# EasyEDA schematic HF Upconverter Schematic (EasyEDA).json
TITLE: HF Upconverter; REV: 2.1.1; Date: 2018-02-09; Sheet: 1/1; Drawn By: IgrikXD
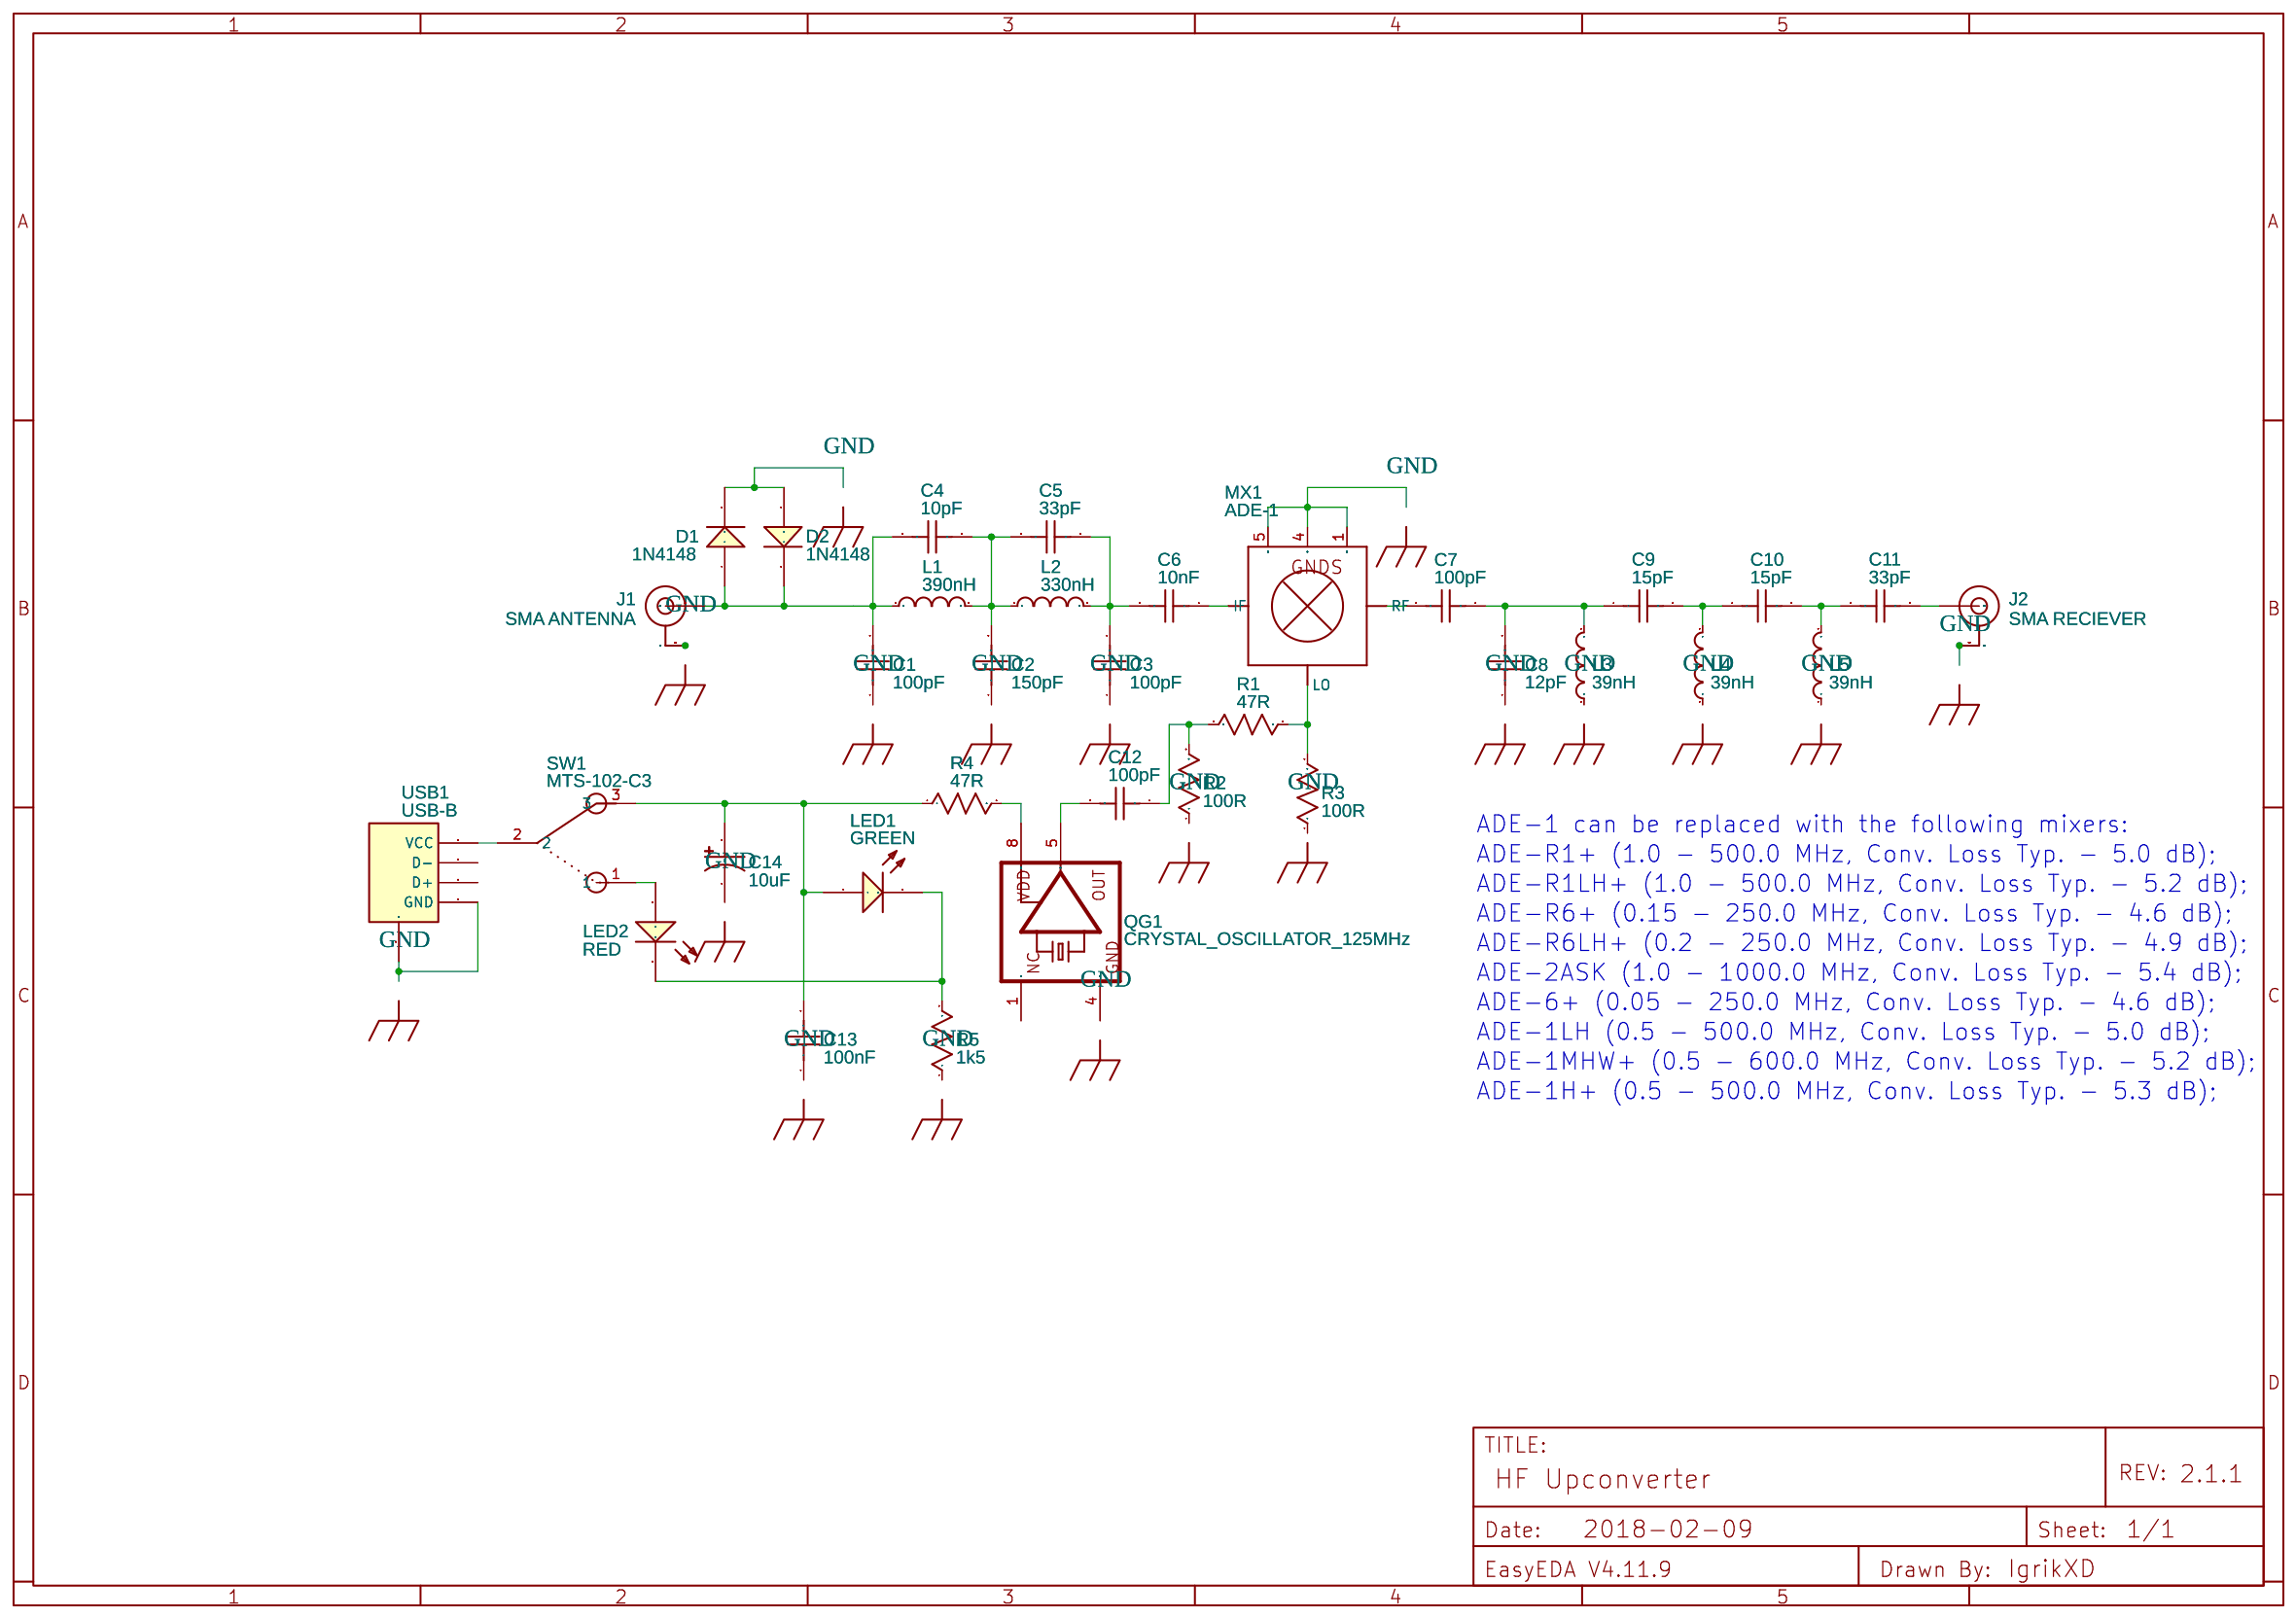
[diagram p0: schematic sheet]

## Parts
C1  100pF  [RAD-0.2]
C2  150pF  [RAD-0.2]
C3  100pF  [RAD-0.2]
C4  10pF  [RAD-0.2]
C5  33pF  [RAD-0.2]
C6  10nF  [RAD-0.2]
C7  100pF  [RAD-0.2]
C8  12pF  [RAD-0.2]
C9  15pF  [RAD-0.2]
C10  15pF  [RAD-0.2]
C11  33pF  [RAD-0.2]
C12  100pF  [RAD-0.2]
C13  100nF  [RAD-0.2]
C14  10uF  [CAP-D5.0XF2.0]
D1  1N4148  [DO-35]
D2  1N4148  [DO-35]
J1  SMA ANTENNA  [SMA-EDGE]
J2  SMA RECIEVER  [SMA-EDGE]
L1  390nH  [AXIAL-0.4]
L2  330nH  [AXIAL-0.4]
L3  39nH  [AXIAL-0.4]
L4  39nH  [AXIAL-0.4]
L5  39nH  [AXIAL-0.4]
LED1  GREEN  [LED-3MM/2.54]
LED2  RED  [LED-3MM/2.54]
MX1  ADE-1  [CD636]
QG1  CRYSTAL_OSCILLATOR_125MHz  [CRYSTAL-OSCILLATOR]
R1  47R  [AXIAL-0.3]
R2  100R  [AXIAL-0.3]
R3  100R  [AXIAL-0.3]
R4  47R  [AXIAL-0.3]
R5  1k5  [AXIAL-0.3]
SW1  MTS-102-C3  [MTS-102-C3]
USB1  USB-B  [USB TYPE B]

## Library data of the parts
C1-C14 = Capacitor: Manufacturer Part: ?
D1 D2 = -: LCSC: C14516; Supplier: LCSC; Manufacturer: ST
J1 J2 = -: SMA Antenna Connector; catid: 20; Contributor: Pinoccio; Manufacturer Part: ?
L1-L5 = Inductor: Manufacturer Part: ?
LED1 LED2 = -: LCSC: C73643; Supplier: LCSC; Manufacturer: EVERLIGHT; Manufacturer Part: 204-10UYC/S530-A3
MX1 = -: catid: 20; Manufacturer Part: ?
QG1 = -: CRYSTAL OSCILLATOR; catid: 20; Manufacturer Part: ?
R1-R5 = Resistor: Manufacturer Part: ?
SW1 = -: Contributor: snhunter; sourceId: LjTecMmIi; Manufacturer Part: ?
USB1 = -: EasyEDA: C46392; Supplier: EasyEDA; Manufacturer: EasyEDA; Manufacturer Part: USB B 90

## Nets
GND: C1.1 C2.1 C3.1 C8.1 C13.1 C14.2 D1.2(K) D2.1(A) J1.GND@0(GND) J1.GND@1(GND) J1.GND@2(GND) J1.GND@3(GND) J2.GND@0(GND) J2.GND@1(GND) J2.GND@2(GND) J2.GND@3(GND) L3.1 L4.1 L5.1 MX1.1(GND) MX1.4(GND) MX1.5(GND) QG1.4(VSS) R2.1 R5.1 USB1.4(GND) USB1.5(CASE)
Net-(C1-2): C1.2 C4.2 D1.1(A) D2.2(K) J1.SIG(SIGNAL) L1.1
Net-(C2-2): C2.2 C4.1 C5.2 L1.2 L2.1
Net-(C3-2): C3.2 C5.1 C6.2 L2.2
Net-(C6-1): C6.1 MX1.2(IF)
Net-(C7-1): C7.1 C8.2 C9.1 L3.2
Net-(C7-2): C7.2 MX1.3(RF)
Net-(C9-2): C9.2 C10.1 L4.2
Net-(C10-2): C10.2 C11.1 L5.2
Net-(C11-2): C11.2 J2.SIG(SIGNAL)
Net-(C12-1): C12.1 R1.2 R2.2
Net-(C12-2): C12.2 QG1.5(OUT)
Net-(C13-2): C13.2 C14.1 LED1.1(A) R4.1 SW1.3
Net-(LED1-2): LED1.2(C) LED2.2(C) R5.2
Net-(LED2-1): LED2.1(A) SW1.1
Net-(MX1-6): MX1.6(LO) R1.1 R3.2
Net-(QG1-8): QG1.8(CON) R4.2
Net-(SW1-2): SW1.2 USB1.1(VCC)

Not connected (* = marked no-connect by the designer): QG1 1(VDD); R3 1; USB1 2(D-) 3(D+)

## Notes on the sheet
- ADE-1 can be replaced with the following mixers:
- ADE-R1+ (1.0 - 500.0 MHz, Conv. Loss Typ. - 5.0 dB);
- ADE-R1LH+ (1.0 - 500.0 MHz, Conv. Loss Typ. - 5.2 dB);
- ADE-R6+ (0.15 - 250.0 MHz, Conv. Loss Typ. - 4.6 dB);
- ADE-R6LH+ (0.2 - 250.0 MHz, Conv. Loss Typ. - 4.9 dB);
- ADE-2ASK (1.0 - 1000.0 MHz, Conv. Loss Typ. - 5.4 dB);
- ADE-6+ (0.05 - 250.0 MHz, Conv. Loss Typ. - 4.6 dB);
- ADE-1LH (0.5 - 500.0 MHz, Conv. Loss Typ. - 5.0 dB);
- ADE-1MHW+ (0.5 - 600.0 MHz, Conv. Loss Typ. - 5.2 dB);
- ADE-1H+ (0.5 - 500.0 MHz, Conv. Loss Typ. - 5.3 dB);
